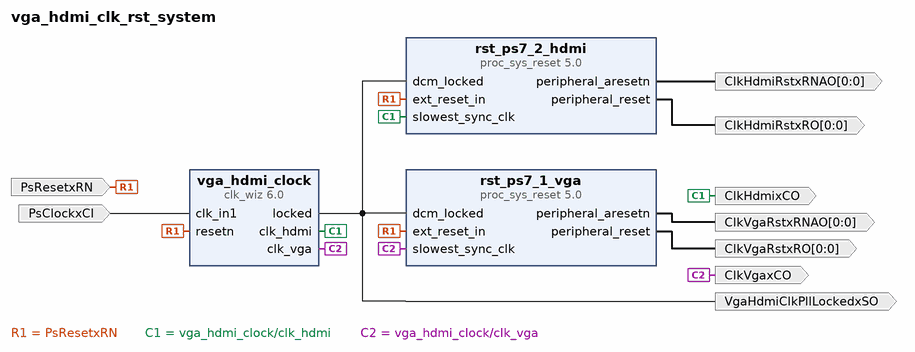
[diagram p0: block diagram of the top level]
# Vivado block design vga_hdmi_clk_rst_system, xc7z015clg485-2, Vivado 2025.2
create_bd_design vga_hdmi_clk_rst_system

create_bd_port -dir O -from 0 -to 0 -type rst ClkHdmiRstxRNAO
create_bd_port -dir O -from 0 -to 0 -type rst ClkHdmiRstxRO
create_bd_port -dir O -type clk ClkHdmixCO
set_property -dict {CONFIG.ASSOCIATED_RESET ClkHdmiRstxRO:ClkHdmiRstxRNAO} [get_bd_ports ClkHdmixCO]
create_bd_port -dir O -from 0 -to 0 -type rst ClkVgaRstxRNAO
create_bd_port -dir O -from 0 -to 0 -type rst ClkVgaRstxRO
create_bd_port -dir O -type clk ClkVgaxCO
set_property -dict {CONFIG.ASSOCIATED_RESET ClkVgaRstxRO:ClkVgaRstxRNAO} [get_bd_ports ClkVgaxCO]
create_bd_port -dir O VgaHdmiClkPllLockedxSO
create_bd_port -dir I -type rst PsResetxRN
create_bd_port -dir I -type clk PsClockxCI
set_property -dict {CONFIG.ASSOCIATED_RESET PsResetxRN CONFIG.FREQ_HZ 125000000} [get_bd_ports PsClockxCI]

create_bd_cell -type ip -vlnv xilinx.com:ip:clk_wiz:6.0 vga_hdmi_clock
set_property -dict [list \
  CONFIG.CLKIN1_JITTER_PS 80.0 \
  CONFIG.CLKOUT1_JITTER 197.699 \
  CONFIG.CLKOUT1_PHASE_ERROR 222.305 \
  CONFIG.CLKOUT1_REQUESTED_OUT_FREQ 48 \
  CONFIG.CLKOUT2_JITTER 157.195 \
  CONFIG.CLKOUT2_PHASE_ERROR 222.305 \
  CONFIG.CLKOUT2_REQUESTED_OUT_FREQ 240 \
  CONFIG.CLKOUT2_USED true \
  CONFIG.CLK_OUT1_PORT clk_vga \
  CONFIG.CLK_OUT2_PORT clk_hdmi \
  CONFIG.MMCM_CLKFBOUT_MULT_F 48.000 \
  CONFIG.MMCM_CLKIN1_PERIOD 8.000 \
  CONFIG.MMCM_CLKOUT0_DIVIDE_F 25.000 \
  CONFIG.MMCM_CLKOUT1_DIVIDE 5 \
  CONFIG.MMCM_DIVCLK_DIVIDE 5 \
  CONFIG.NUM_OUT_CLKS 2 \
  CONFIG.PRIM_SOURCE Global_buffer \
  CONFIG.RESET_PORT resetn \
  CONFIG.RESET_TYPE ACTIVE_LOW \
] [get_bd_cells vga_hdmi_clock]
create_bd_cell -type ip -vlnv xilinx.com:ip:proc_sys_reset:5.0 rst_ps7_1_vga
create_bd_cell -type ip -vlnv xilinx.com:ip:proc_sys_reset:5.0 rst_ps7_2_hdmi

# ---- connections ----

connect_bd_net -net clk_in1_0_1 [get_bd_ports PsClockxCI] [get_bd_pins vga_hdmi_clock/clk_in1]
connect_bd_net -net resetn_0_1 [get_bd_ports PsResetxRN] \
  [get_bd_pins rst_ps7_1_vga/ext_reset_in] [get_bd_pins rst_ps7_2_hdmi/ext_reset_in] [get_bd_pins vga_hdmi_clock/resetn]
connect_bd_net [get_bd_pins rst_ps7_1_vga/peripheral_aresetn] [get_bd_ports ClkVgaRstxRNAO]
connect_bd_net [get_bd_pins rst_ps7_1_vga/peripheral_reset] [get_bd_ports ClkVgaRstxRO]
connect_bd_net [get_bd_pins rst_ps7_2_hdmi/peripheral_aresetn] [get_bd_ports ClkHdmiRstxRNAO]
connect_bd_net [get_bd_pins rst_ps7_2_hdmi/peripheral_reset] [get_bd_ports ClkHdmiRstxRO]
connect_bd_net [get_bd_pins vga_hdmi_clock/clk_hdmi] [get_bd_ports ClkHdmixCO] [get_bd_pins rst_ps7_2_hdmi/slowest_sync_clk]
connect_bd_net [get_bd_pins vga_hdmi_clock/clk_vga] [get_bd_ports ClkVgaxCO] [get_bd_pins rst_ps7_1_vga/slowest_sync_clk]
connect_bd_net [get_bd_pins vga_hdmi_clock/locked] \
  [get_bd_ports VgaHdmiClkPllLockedxSO] [get_bd_pins rst_ps7_1_vga/dcm_locked] [get_bd_pins rst_ps7_2_hdmi/dcm_locked]

validate_bd_design
save_bd_design
